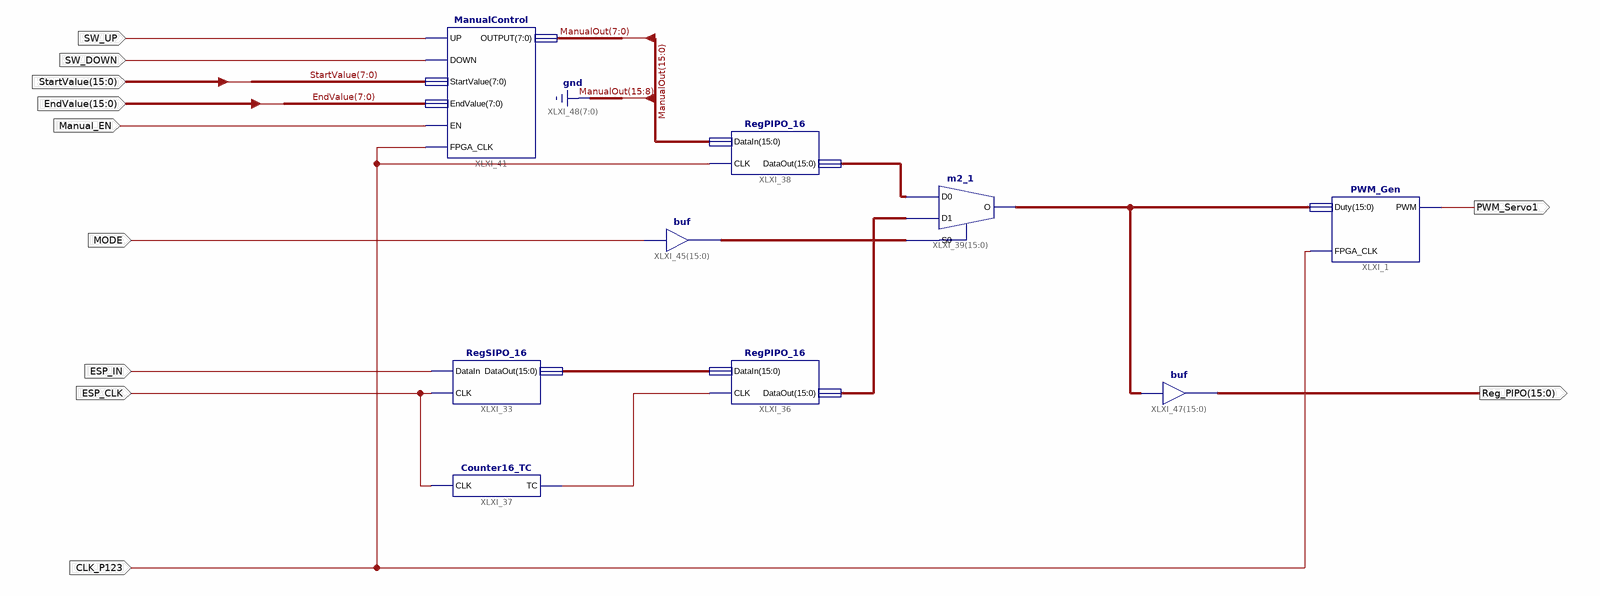
[diagram p0: schematic sheet 1]
// Xilinx ISE schematic ServoControl.sch (spartan6) as structural Verilog: 9 symbols, 11 ports
module ServoControl (
  input  ESP_IN,
  input  CLK_P123,
  input  ESP_CLK,
  input  SW_UP,
  input  SW_DOWN,
  input  [15:0] StartValue,
  input  [15:0] EndValue,
  input  Manual_EN,
  input  MODE,
  output PWM_Servo1,
  output [15:0] Reg_PIPO
);

  wire XLXN_70;
  wire [7:0] ManualOut;
  wire [15:0] XLXN_78, XLXN_79, XLXN_84, XLXN_103, XLXN_109;

  RegSIPO_16 XLXI_33 (.DataOut(XLXN_78), .DataIn(ESP_IN), .CLK(ESP_CLK));
  RegPIPO_16 XLXI_36 (.CLK(XLXN_70), .DataOut(XLXN_103), .DataIn(XLXN_78));
  Counter16_TC XLXI_37 (.CLK(ESP_CLK), .TC(XLXN_70));
  PWM_Gen XLXI_1 (.Duty(XLXN_109), .FPGA_CLK(CLK_P123), .PWM(PWM_Servo1));
  m2_1 XLXI_39[15:0] (.D0(XLXN_79), .D1(XLXN_103), .S0(XLXN_84), .O(XLXN_109));
  RegPIPO_16 XLXI_38 (.CLK(CLK_P123), .DataOut(XLXN_79), .DataIn({{8{1'b0}}, ManualOut}));
  ManualControl XLXI_41 (
    .DOWN(SW_DOWN), .UP(SW_UP), .EN(Manual_EN), .StartValue(StartValue[7:0]), .EndValue(EndValue[7:0]),
    .FPGA_CLK(CLK_P123), .OUTPUT(ManualOut));
  assign XLXN_84 = {16{MODE}};  // buf XLXI_45[15..0], 16 bits wide
  assign Reg_PIPO = XLXN_109;  // buf XLXI_47[15..0], 16 bits wide
endmodule
